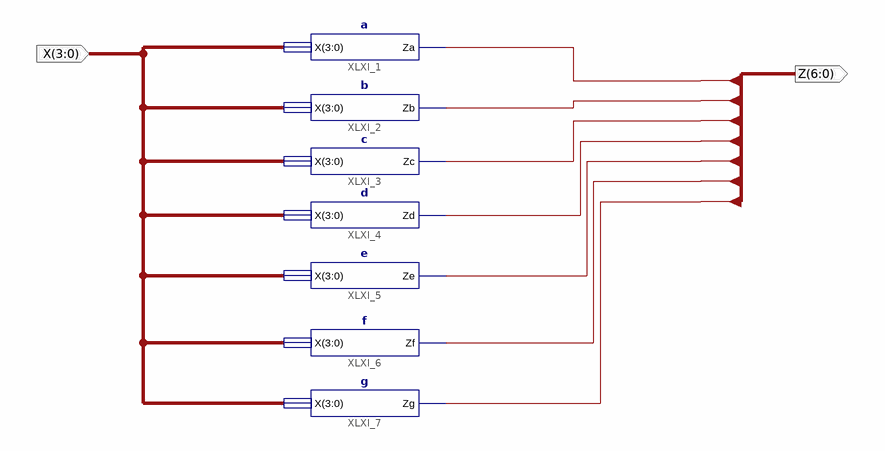
[diagram p0: schematic sheet 1]
// Xilinx ISE schematic bcd.sch (spartan3e) as structural Verilog: 7 symbols, 2 ports
module bcd (
  input  [3:0] X,
  output [6:0] Z
);

  a XLXI_1 (.X(X), .Za(Z[0]));
  b XLXI_2 (.X(X), .Zb(Z[1]));
  c XLXI_3 (.X(X), .Zc(Z[2]));
  d XLXI_4 (.X(X), .Zd(Z[3]));
  e XLXI_5 (.X(X), .Ze(Z[4]));
  f XLXI_6 (.X(X), .Zf(Z[5]));
  g XLXI_7 (.X(X), .Zg(Z[6]));
endmodule
